# Altium schematic sheet SMC.SchDoc
size A2; SheetNumber: 6; SheetTotal: 12
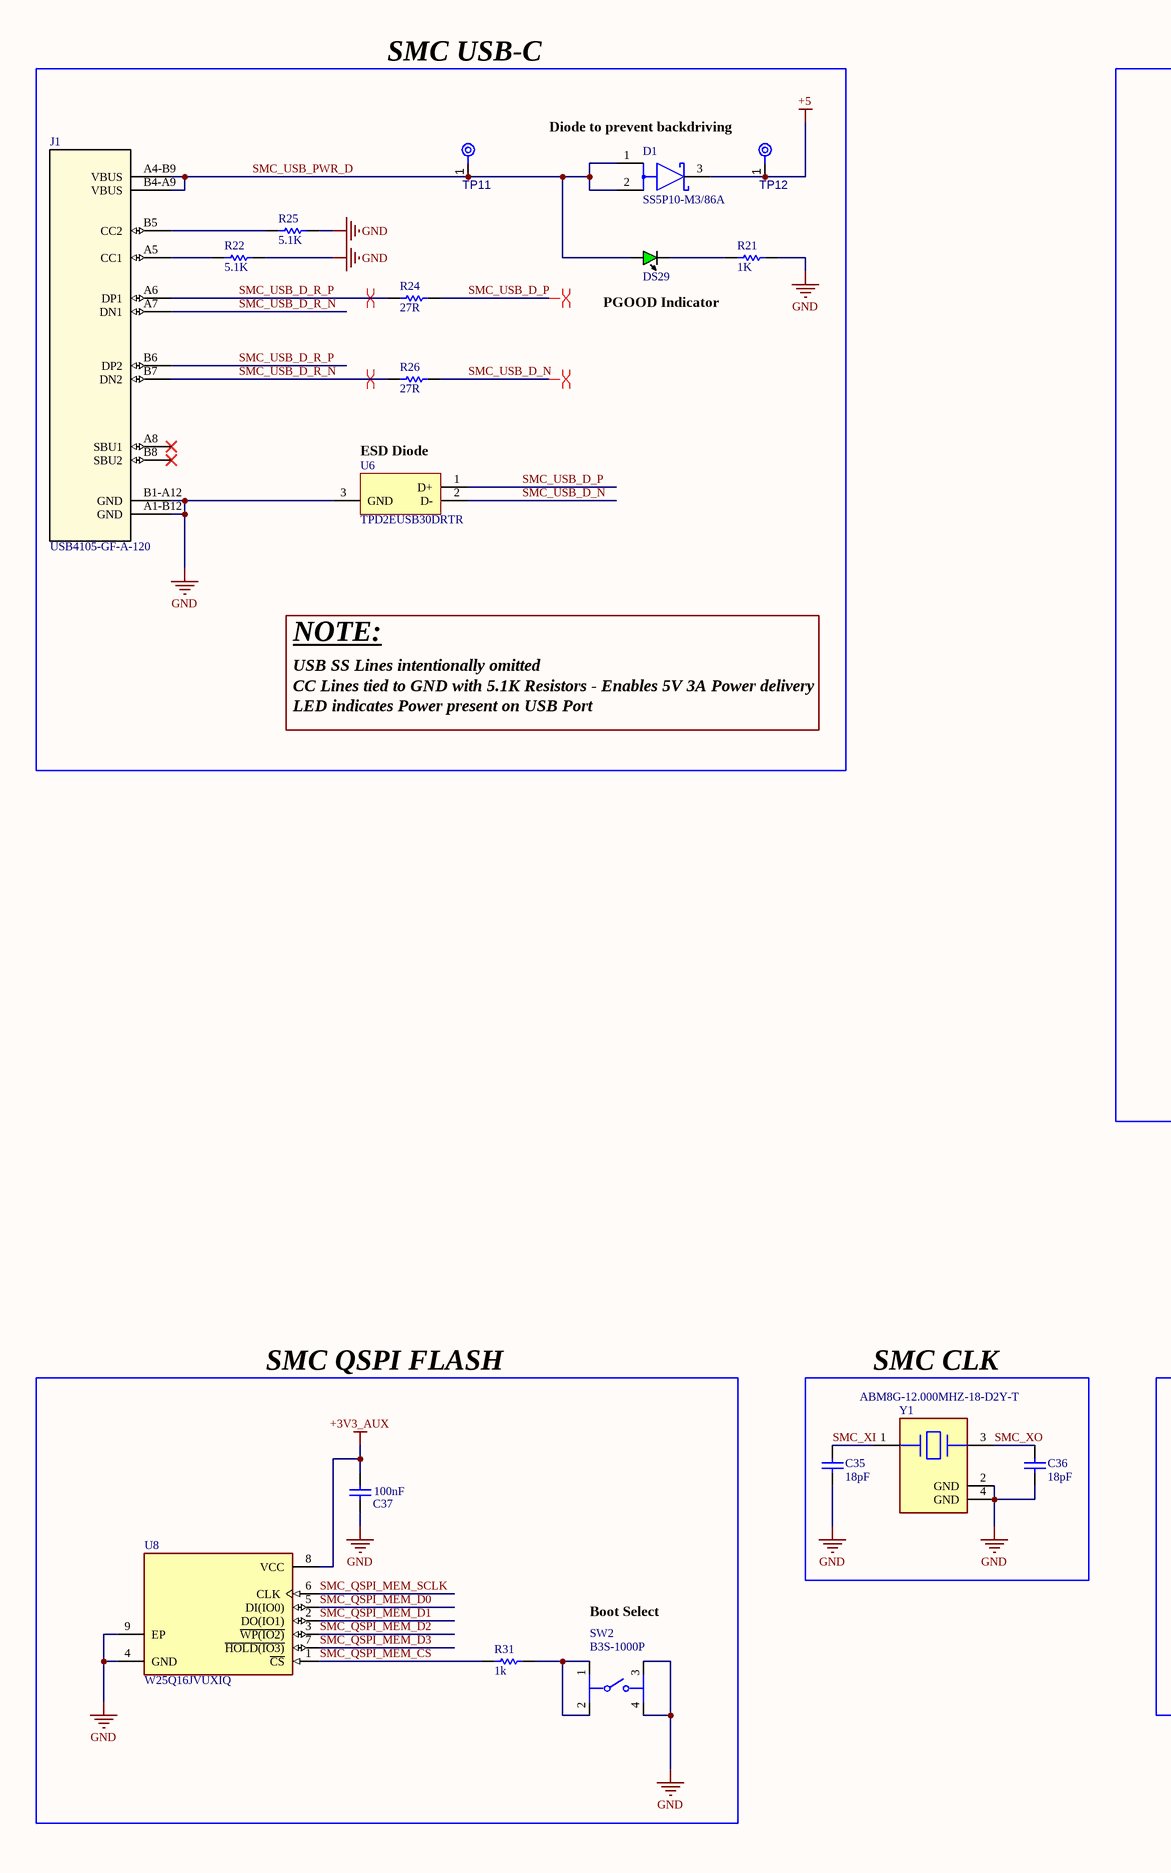
[diagram p0: SMC.SchDoc, left]
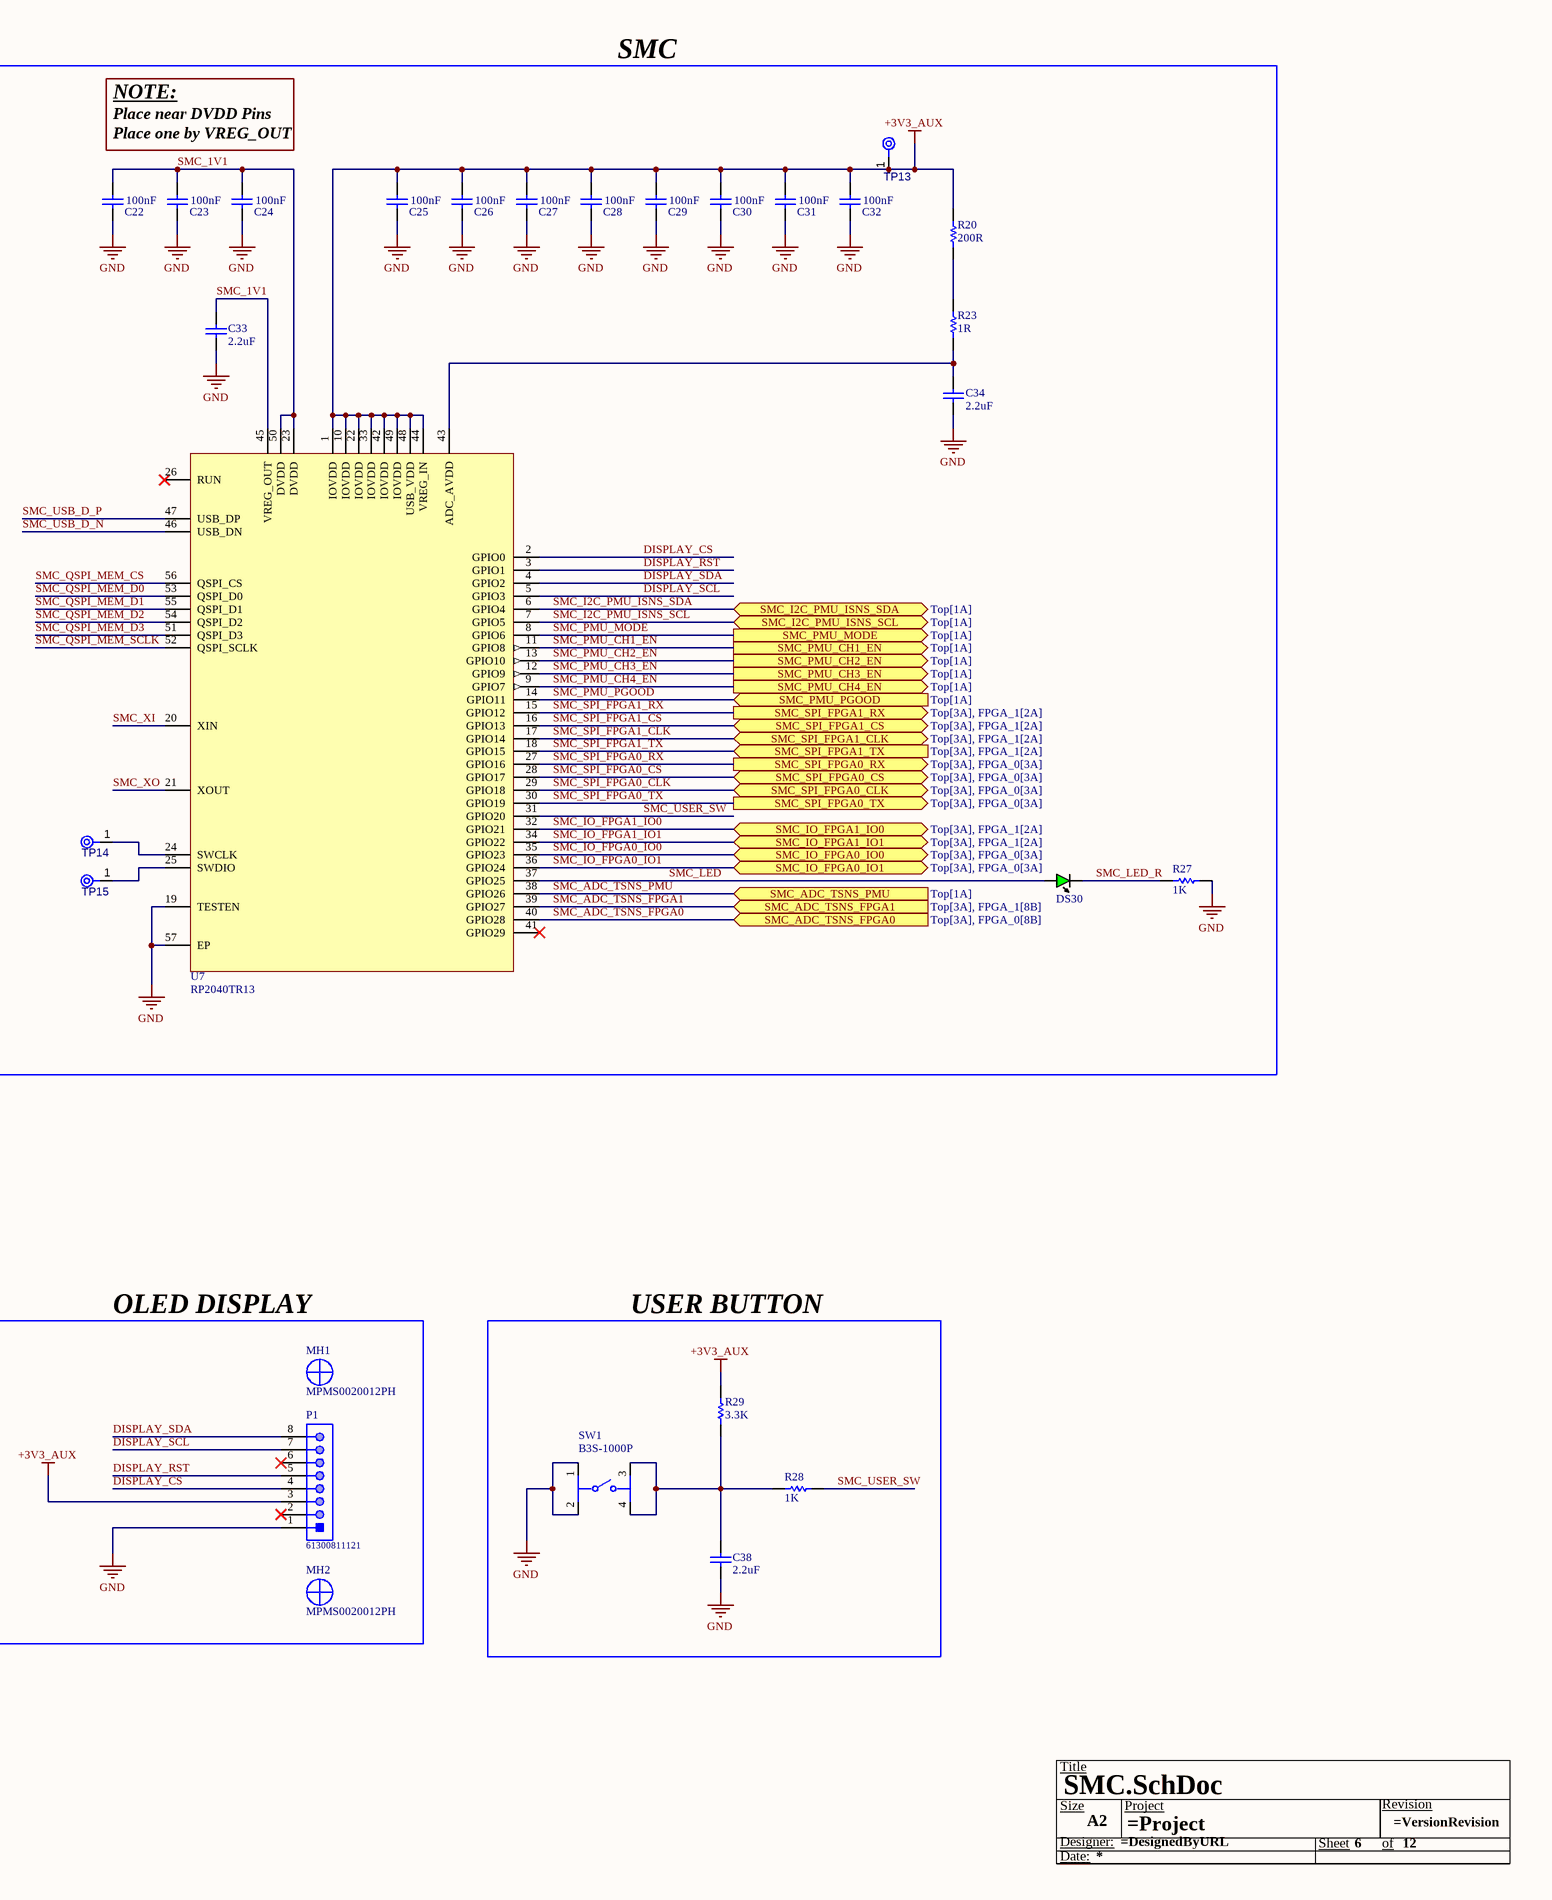
[diagram p1: SMC.SchDoc, right]

## Parts
*  Size: A2  (hidden comment: Title Block)  (graphical)
C22  100nF  [CAPC1005X05N]
C23  100nF  [CAPC1005X05N]
C24  100nF  [CAPC1005X05N]
C25  100nF  [CAPC1005X05N]
C26  100nF  [CAPC1005X05N]
C27  100nF  [CAPC1005X05N]
C28  100nF  [CAPC1005X05N]
C29  100nF  [CAPC1005X05N]
C30  100nF  [CAPC1005X05N]
C31  100nF  [CAPC1005X05N]
C32  100nF  [CAPC1005X05N]
C33  2.2uF  [CAPC1005X55X25NL05T10]
C34  2.2uF  [CAPC1005X55X25NL05T10]
C35  18pF  [CAPC1005X55X25LL05T10]
C36  18pF  [CAPC1005X55X25LL05T10]
C37  100nF  [CAPC1005X05N]
C38  2.2uF  [CAPC1005X55X25NL05T10]
D1  SS5P10-M3/86A  [FP-95570-MFG]
DS29  SMLLX0603GWTR  [LUMX-SML-LX0603_V]  (value not drawn)
DS30  SMLLX0603GWTR  [LUMX-SML-LX0603_V]  (value not drawn)
J1  USB4105-GF-A-120  [USB4105-GF-A-120-Footprint-1]
MH1  MPMS0020012PH  [BF-MPMS0020012PH]
MH2  MPMS0020012PH  [BF-MPMS0020012PH]
P1  61300811121  [61300811121]
R20  200R  [RESC1005X40X25NL05T05]
R21  1K  [RESC1005X40X25NL05T10]
R22  5.1K  [RESC1005X40X25NL05T10]
R23  1R  [RESC1005X40X25NL05T05]
R24  27R  [RESC1005X40X25NL05T10]
R25  5.1K  [RESC1005X40X25NL05T10]
R26  27R  [RESC1005X40X25NL05T10]
R27  1K  [RESC1005X40X25NL05T10]
R28  1K  [RESC1005X40X25NL05T10]
R29  3.3K  [RESC1005X40X25NL05T10]
R31  value 1k  [RESC1005X40X25ML05T05]  (hidden comment: Resistor 1k +/-1% 0402 100 mW)
SW1  B3S-1000P  [FP-B3S-1000P-MFG]
SW2  B3S-1000P  [FP-B3S-1000P-MFG]
TP11  TPAD6R  [TP06R]  (value not drawn)  (no BOM)
TP12  TPAD6R  [TP06R]  (value not drawn)  (no BOM)
TP13  TPAD6R  [TP06R]  (value not drawn)  (no BOM)
TP14  TPAD6R  [TP06R]  (value not drawn)  (no BOM)
TP15  TPAD6R  [TP06R]  (value not drawn)  (no BOM)
U6  TPD2EUSB30DRTR  [DRT0003A]
U7  RP2040TR13  [QFN40P700X700X80_HS-57N]
U8  W25Q16JVUXIQ  [FP-UX-MFG]
Y1  ABM8G-12.000MHZ-18-D2Y-T  [FP-ABM8G-MFG]

## Blocks framed on the sheet
SMC: C22-C34 DS30 R20 R23 R27 TP13-TP15 U7
SMC QSPI FLASH: C37 R31 SW2 U8
SMC CLK: C35 C36 Y1
OLED DISPLAY: MH1 MH2 P1
USER BUTTON: C38 R28 R29 SW1

## Ports
SMC_ADC_TSNS_FPGA0 (in, see Top[3A], FPGA_0[8B]), SMC_ADC_TSNS_FPGA1 (in, see Top[3A], FPGA_1[8B]), SMC_ADC_TSNS_PMU (in, see Top[1A]), SMC_I2C_PMU_ISNS_SCL (bidir, see Top[1A]), SMC_I2C_PMU_ISNS_SDA (bidir, see Top[1A]), SMC_IO_FPGA0_IO0 (bidir, see Top[3A], FPGA_0[3A]), SMC_IO_FPGA0_IO1 (bidir, see Top[3A], FPGA_0[3A]), SMC_IO_FPGA1_IO0 (bidir, see Top[3A], FPGA_1[2A]), SMC_IO_FPGA1_IO1 (bidir, see Top[3A], FPGA_1[2A]), SMC_PMU_CH1_EN (out, see Top[1A]), SMC_PMU_CH2_EN (out, see Top[1A]), SMC_PMU_CH3_EN (out, see Top[1A]), SMC_PMU_CH4_EN (out, see Top[1A]), SMC_PMU_MODE (out, see Top[1A]), SMC_PMU_PGOOD (in, see Top[1A]), SMC_SPI_FPGA0_CLK (bidir, see Top[3A], FPGA_0[3A]), SMC_SPI_FPGA0_CS (bidir, see Top[3A], FPGA_0[3A]), SMC_SPI_FPGA0_RX (out, see Top[3A], FPGA_0[3A]), SMC_SPI_FPGA0_TX (out, see Top[3A], FPGA_0[3A]), SMC_SPI_FPGA1_CLK (bidir, see Top[3A], FPGA_1[2A]), SMC_SPI_FPGA1_CS (bidir, see Top[3A], FPGA_1[2A]), SMC_SPI_FPGA1_RX (out, see Top[3A], FPGA_1[2A]), SMC_SPI_FPGA1_TX (in, see Top[3A], FPGA_1[2A])

## Nets
+3V3_AUX: C25.2 C26.2 C27.2 C28.2 C29.2 C30.2 C31.2 C32.2 C37.2 P1.3 R20.2 R29.2 TP13.1(TP) U7.1(IOVDD) U7.10(IOVDD) U7.22(IOVDD) U7.33(IOVDD) U7.42(IOVDD) U7.44(VREG_IN) U7.48(USB_VDD) U7.49(IOVDD) U8.8(VCC)
+5: D1.3(C) TP12.1(TP)
GND: C22.1 C23.1 C24.1 C25.1 C26.1 C27.1 C28.1 C29.1 C30.1 C31.1 C32.1 C33.1 C34.1 C35.1 C36.1 C37.1 C38.1 J1.A1-B12(GND) J1.B1-A12(GND) P1.1 R21.1 R22.2 R25.2 R27.1 SW1.1 SW1.2 SW2.3 SW2.4 U6.3(GND) U7.19(TESTEN) U7.57(EP) U8.4(GND) U8.9(EP) Y1.2(GND) Y1.4(GND)
DISPLAY_CS: P1.4 U7.2(GPIO0)
DISPLAY_RST: P1.5 U7.3(GPIO1)
DISPLAY_SCL: P1.7 U7.5(GPIO3)
DISPLAY_SDA: P1.8 U7.4(GPIO2)
SMC_1V1: C22.2 C23.2 C24.2 C33.2 U7.23(DVDD) U7.45(VREG_OUT) U7.50(DVDD)
SMC_ADC_TSNS_FPGA0: U7.40(GPIO28) ; port SMC_ADC_TSNS_FPGA0
SMC_ADC_TSNS_FPGA1: U7.39(GPIO27) ; port SMC_ADC_TSNS_FPGA1
SMC_ADC_TSNS_PMU: U7.38(GPIO26) ; port SMC_ADC_TSNS_PMU
SMC_I2C_PMU_ISNS_SCL: U7.7(GPIO5) ; port SMC_I2C_PMU_ISNS_SCL
SMC_I2C_PMU_ISNS_SDA: U7.6(GPIO4) ; port SMC_I2C_PMU_ISNS_SDA
SMC_IO_FPGA0_IO0: U7.35(GPIO23) ; port SMC_IO_FPGA0_IO0
SMC_IO_FPGA0_IO1: U7.36(GPIO24) ; port SMC_IO_FPGA0_IO1
SMC_IO_FPGA1_IO0: U7.32(GPIO21) ; port SMC_IO_FPGA1_IO0
SMC_IO_FPGA1_IO1: U7.34(GPIO22) ; port SMC_IO_FPGA1_IO1
SMC_LED: DS30.1(A) U7.37(GPIO25)
SMC_LED_R: DS30.2(K) R27.2
SMC_PMU_CH1_EN: U7.11(GPIO8) ; port SMC_PMU_CH1_EN
SMC_PMU_CH2_EN: U7.13(GPIO10) ; port SMC_PMU_CH2_EN
SMC_PMU_CH3_EN: U7.12(GPIO9) ; port SMC_PMU_CH3_EN
SMC_PMU_CH4_EN: U7.9(GPIO7) ; port SMC_PMU_CH4_EN
SMC_PMU_MODE: U7.8(GPIO6) ; port SMC_PMU_MODE
SMC_PMU_PGOOD: U7.14(GPIO11) ; port SMC_PMU_PGOOD
SMC_QSPI_MEM_CS: R31.1 U7.56(QSPI_CS) U8.1(~{CS})
SMC_QSPI_MEM_D0: U7.53(QSPI_D0) U8.5(DI(IO0))
SMC_QSPI_MEM_D1: U7.55(QSPI_D1) U8.2(DO(IO1))
SMC_QSPI_MEM_D2: U7.54(QSPI_D2) U8.3(~{WP(IO2)})
SMC_QSPI_MEM_D3: U7.51(QSPI_D3) U8.7(~{HOLD(IO3)})
SMC_QSPI_MEM_SCLK: U7.52(QSPI_SCLK) U8.6(CLK)
SMC_SPI_FPGA0_CLK: U7.29(GPIO18) ; port SMC_SPI_FPGA0_CLK
SMC_SPI_FPGA0_CS: U7.28(GPIO17) ; port SMC_SPI_FPGA0_CS
SMC_SPI_FPGA0_RX: U7.27(GPIO16) ; port SMC_SPI_FPGA0_RX
SMC_SPI_FPGA0_TX: U7.30(GPIO19) ; port SMC_SPI_FPGA0_TX
SMC_SPI_FPGA1_CLK: U7.17(GPIO14) ; port SMC_SPI_FPGA1_CLK
SMC_SPI_FPGA1_CS: U7.16(GPIO13) ; port SMC_SPI_FPGA1_CS
SMC_SPI_FPGA1_RX: U7.15(GPIO12) ; port SMC_SPI_FPGA1_RX
SMC_SPI_FPGA1_TX: U7.18(GPIO15) ; port SMC_SPI_FPGA1_TX
SMC_USB_D_N: R26.2 U6.2(D-) U7.46(USB_DN)
SMC_USB_D_P: R24.2 U6.1(D+) U7.47(USB_DP)
SMC_USB_D_R_N: J1.A7(DN1) J1.B7(DN2) R26.1
SMC_USB_D_R_P: J1.A6(DP1) J1.B6(DP2) R24.1
SMC_USB_PWR_D: D1.1(A) D1.2(A) DS29.1(A) J1.A4-B9(VBUS) J1.B4-A9(VBUS) TP11.1(TP)
SMC_USER_SW: R28.1 U7.31(GPIO20)
SMC_XI: C35.2 U7.20(XIN) Y1.1
SMC_XO: C36.2 U7.21(XOUT) Y1.3
NetC34_2: C34.2 R23.1 U7.43(ADC_AVDD)
NetC38_2: C38.2 R28.2 R29.1 SW1.3 SW1.4
NetDS29_2: DS29.2(K) R21.2
NetJ1_A5: J1.A5(CC1) R22.1
NetJ1_B5: J1.B5(CC2) R25.1
NetR20_1: R20.1 R23.2
NetR31_2: R31.2 SW2.1 SW2.2
NetTP14_1: TP14.1(TP) U7.24(SWCLK)
NetTP15_1: TP15.1(TP) U7.25(SWDIO)

Not connected (* = marked no-connect by the designer): J1 A8(SBU1)* B8(SBU2)*; MH1 1; MH2 1; P1 2* 6*; U7 26(RUN)* 41(GPIO29)*

## Layout directives
differential pair: SMC_USB_D_N, SMC_USB_D_P, SMC_USB_D_R_N, SMC_USB_D_R_P

## Notes on the sheet
- SMC USB-C
- Place near DVDD Pins
- NOTE:
- Diode to prevent backdriving
- Place one by VREG_OUT
- PGOOD Indicator
- (near U6) ESD Diode
- USB SS Lines intentionally omitted
- CC Lines tied to GND with 5.1K Resistors - Enables 5V 3A Power delivery
- LED indicates Power present on USB Port
- Boot Select
- (in symbol CMP-007-000006-8) Title; Size; Project; Revision; Designer:; Sheet; of; Date:

## Library data of the parts
* = CMP-007-000006-8: Generic Title Block
C22-C32 C37 = CMP-001-00095-1: Cap Ceramic 0.1uF 50V X7R 20% SMD 0402 125°C Paper T/R GRM155R71H104ME14J; Voltage: 50V; Capacitance: 100nF; Case: 0402
C33 C34 C38 = CMP-2008-04543-1: GRM155R60J225ME15D; Manufacturer: Murata; Part Number: GRM155R60J225ME15D
C35 C36 = CMP-2000-06328-1: Chip Capacitor, 18 pF, +/- 5%, 50 V, -55 to 125 degC, 0402 (1005 Metric), RoHS, Tape and Reel GRM1555C1H180JZ01D; Manufacturer: Murata; Other Names: 490-1281-6; Voltage - Rated: 50V; Temperature Coefficient: C0G,NP0; Catalog Drawings: GRMSeries_0402(0.5mmThickness); Applications: GeneralPurpose; Datasheet Version: 10/2016; Mounting Type: SurfaceMount,MLCC; Features: -; Package Reference: 0402; Thickness (Max): 0.022"(0.55mm); Capacitance: 18pF; Height - Seated (Max): -; Size / Dimension: 0.039"Lx0.020"W(1.00mmx0.50mm); Package / Case: 0402(1005Metric); Lead Style: -; Series: GRM; Mounting Technology: SurfaceMount; Package Description: 2-Pin Surface Mount Device, Body 1 x 0.5 mm; Family: CeramicCapacitors; Tolerance: ±5%; Category: Capacitors; Datasheet URL: http://psearch.en.murata.com/capacitor/product/GRM1555C1H180JZ01_.pdf; Ratings: -; Lead Spacing: -; Standard Package: 1; Operating Temperature: -55°C~125°C; Packaging: Digi-Reel®; Manufacturer URL: http://www.murata.com/
D1 = CMP-02539-000057-1: DIODE SCHOTTKY 100V 5A TO277A; Max Forward Surge Current (Ifsm): 150A; Element Configuration: Common Cathode; Max Reverse Leakage Current: 15uA; Forward Voltage: 880mV; Case/Package: TO-277A; Number of Pins: 3; Max Reverse Voltage (DC): 100V; Height: 0.031inch; Peak Non-Repetitive Surge Current: 150A; Series: eSMP®; Radiation Hardening: No; Length: 0.242inch; Max Repetitive Reverse Voltage (Vrrm): 100V; Forward Current: 5A; Width: 0.171inch; Min Operating Temperature: -55°C; Max Surge Current: 150A; Lead Free: Lead Free; RoHS Compliant: Yes; Average Rectified Current: 5A; Max Operating Temperature: 150°C; Max Reverse Current: 15uA; Package Quantity: 1500; Packaging: Tape and Reel; Mount: Surface Mount
DS29 DS30 = CMP-007-00037-1: LED GREEN DIFFUSED SMD; Color: Green; Case/Package: 0603
J1 = CMP-002-00073-2: USB CONN, 2.0 TYPE C, RCPT, 16POS, SMT; USB Connector Type: USB Type C; USB Standard: USB 2.0; Gender: Receptacle;...
MH1 MH2 = CMP-00028-00000-1: Copper Pillar, M2 Screw; Manufacturer: B&F Fastener Supply; Screw Head Type: PanHead; Drive Type: Phillips; Package Reference: MPMS0020012PH; Pins: 1; Datasheet URL: https://datasheet.ciiva.com/1034/metd7985a-1034196.pdf; Type: MachineScrew; Manufacturer URL: http://www.bffastenersupply.com/; Case/Package: MPMS0020012PH; Datasheet Version: 42095; Mounting Technology: TH; Thread Size: M2; Package Description: 1-Pin Surface Mount Device, Diameter 3.7 mm; RoHS Compliant: False
P1 = CMP-1502-01076-1: THT Vertical Pin Header WR-PHD, Pitch 2.54 mm, Single Row, 8 pins; Manufacturer: Wurth Elektronik; Rated Current: 3A; Pin Number: 8; Working Voltage: 250VAC; Gender: Male; Contact Resistance: 20mOhm; Pitch: 2.54mm; Withstanding Voltage: 500VAC; Publisher: WurthElektronik; Operating Temperature: -40to105degC; Orientation: Vertical; Row Number: Single; Part Number: 61300811121; Package Reference: 61300811121; Mounting Technology: THT; Packaging: Bag; Manufacturer URL: http://www.we-online.de; Datasheet URL: https://katalog.we-online.de/em/datasheet/6130xx11121.pdf
R20 = CMP-2002-08353-1: CRCW0402200RJNED; Manufacturer: Vishay Dale; Part Number: CRCW0402200RJNED
R21 R27 R28 = CMP-2002-03045-1: CRCW04021K00FKEDHP; Manufacturer: Vishay Dale; Part Number: CRCW04021K00FKEDHP
R22 R25 = CMP-2002-07753-1: RC0402FR-075K1L; Manufacturer: Yageo / Phycomp; Part Number: RC0402FR-075K1L
R23 = CMP-2002-08342-1: CRCW04021R00FKED; Manufacturer: Vishay Dale; Part Number: CRCW04021R00FKED
R24 R26 = CMP-1011-00036-2: RC0402JR-0727RL; Manufacturer: Yageo / Phycomp; Part Number: RC0402JR-0727RL
R29 = CMP-2002-03055-1: CRCW04023K30FKEDHP; Manufacturer: Vishay Dale; Part Number: CRCW04023K30FKEDHP
R31 = CMP-009-00009-4: Chip Resistor, 1 KOhm, +/- 1%, 0.1 W, -55 to 155 degC, 0402 (1005 Metric); Power: 100mW; Voltage Rating: 50V; Max Operating Temperature: 155°C; Min Operating Temperature: -55°C; RoHS Compliant: True; Case/Package: 0402; Mounting Technology: SM; Tolerance: 1%; Pins: 2
SW1 SW2 = CMP-08834-000008-1: SWITCH TACTILE SPST-NO 0.05A 24V; Throw Configuration: SPST; Switch Function: Off-Mom; Switch Travel: 0.25mm; Contact Current Rating: 50mA; Actuator Length: 0.8mm; Mechanical Life: 500000Cycles; Contact Resistance: 100mR; Operating Force: 1.57N; Actuator Type: Standard; Illumination Type: Non-Illuminated; Ratings: IP67; Number of Poles: 1; Package Quantity: 1; Orientation: Straight; REACH SVHC: No SVHC; Lead Free: Lead Free; Max Current Rating: 50mA; Contact Plating: Silver; Current Rating: 50mA; Depth: 9mm; Contact Material: Bronze; Electrical Life: 500000Cycles; Termination: Gull Wing; Width: 6mm; Packaging: Tape and Reel; Min Operating Temperature: -25°C; Radiation Hardening: No; Max Voltage Rating (DC): 24V; Max Operating Temperature: 70°C; Length: 6.6mm; Height: 3.65mm; Voltage Rating (DC): 24V; Weight: 0.010582oz; Mount: Surface Mount
TP11-TP15 = CMP-00028-00002-1: 0.6mm round; Pins: 1
U6 = CMP-0326-00046-3: ESD Solution for Super-Speed (6 Gbps) USB 3.0 Interface, 2 Channels, -40 to +85 degC, 3-pin SOT (DRT), Green (Rohs & No Sb/Br); Manufacturer: Texas Instruments; Differential Capacitance(pF): 0.01; Breakdown Voltage(Min)(V): 9; HDMI: TRUE; IEC 61000-4-2 Air-Gap(+/- kV): 8; IO Leakage Current(nA): 10; IO Capacitance(Typ)(pF): 0.7; Mounting Technology: Surface Mount; PackageDescription: 3-Flat Lead Plastic Small Outline, 1 x 1 mm (inc leads), 0.35 mm Pitch; IEC 61000-4-2 Contact(+/- kV): 8; USB Super Speed: TRUE; Eco-Plan: Green (RoHS & no Sb/Br); USB High Speed: TRUE; PackageReference: DRT0003A; SubFamily: ESD Solution; USB Full Speed: TRUE; ComponentLink1Description: Datasheet; ComponentLink2URL: SamplesURL:http://www.ti.com/product/tpd2eusb30#samples; PackageVersion: revD, Jun-2008; ComponentLink2Description: URL Link1; 1394 / Firewire: TRUE; PartNumber: TPD2EUSB30DRTR; ComponentLink1URL: http://www.ti.com/general/docs/lit/getliterature.tsp?genericPartNumber=TPD2EUSB30&fileType=pdf; DatasheetVersion: SLVSAC2C; Serial ATA / eSATA: TRUE
U7 = CMP-020-00027-1: Mcu, 32 Bit, 133MHZ, QFN-56;
U8 = CMP-78876-000011-1: IC FLASH 16MBIT SPI/QUAD 8USON; RoHS Compliant: Yes
Y1 = CMP-2000-05039-3: Crystal 12MHz ±20ppm (Tol) ±30ppm (Stability) 18pF FUND 120Ω 4-Pin SMD T/R; Series Resistance: 120R; Max Operating Temperature: 85°C; Mount: Surface Mount; Width: 2.5mm; Series: ABM8G; Termination: SMD/SMT; Frequency Tolerance: 20ppm; Tolerance: 20ppm; Min Operating Temperature: -40°C; Operating Frequency: 12 MHz; Depth: 2.5mm; Load Capacitance: 18pF; Number of Pins: 4; Length: 3.2mm; Radiation Hardening: No; Frequency Stability: 30ppm; Height: 1mm; Packaging: Tape and Reel; Package Quantity: 1000; ESR (Equivalent Series Resistance): 120R; Lead Free: Lead Free; Frequency: 12MHz; Case/Package: CSMD